# EAGLE design simple-loop-active (EAGLE 6.6.0)

## Sheet 1 of 2
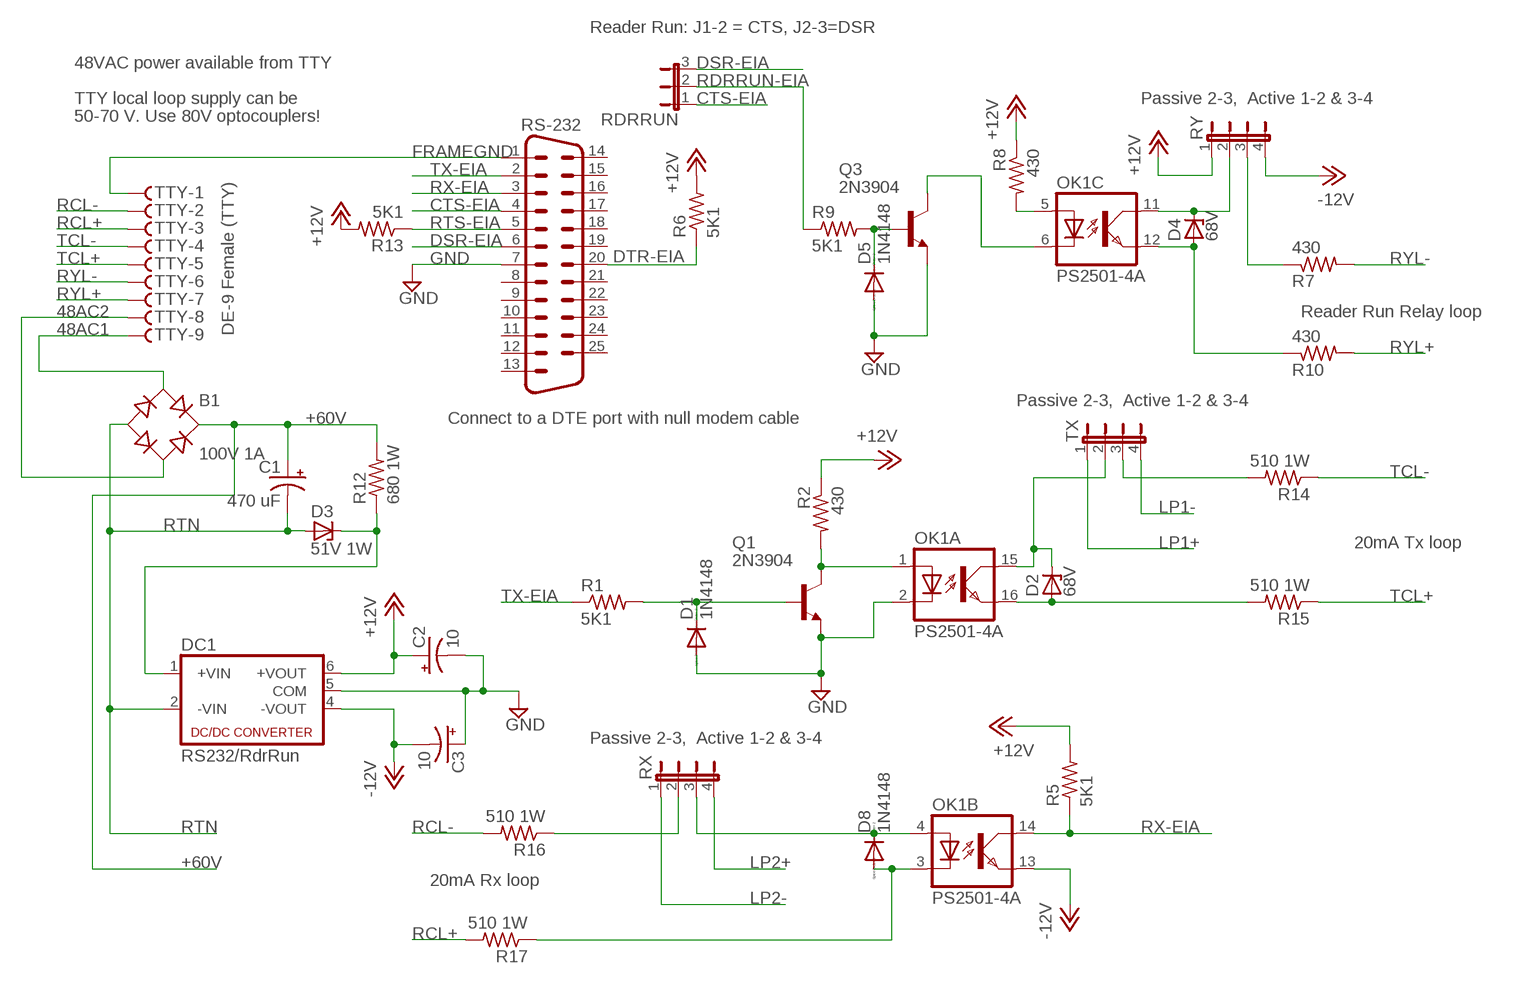
[diagram p0: schematic, sheet 1]

### Parts
B1  100V 1A  RB1A  [RB1A]
C1  470 uF  CPOL-USE7.5-18  [E7,5-18]
C2  10  CPOL-USB45181A  [B45181A]
C3  10  CPOL-USB45181A  [B45181A]
D1  1N4148  1N4148DO35-10  [DO35-10]
D2  68V  ZENER-DIODEDO41Z10  [DO41Z10]
D3  51V 1W  ZENER-DIODEDO41Z10  [DO41Z10]
D4  68V  ZENER-DIODEDO41Z10  [DO41Z10]
D5  1N4148  1N4148DO35-10  [DO35-10]
D8  1N4148  1N4148DO35-10  [DO35-10]
DC1  RS232/RdrRun  NMA  [NMA]
OK1  PS2501-4A  ILQ1  [DIL16]
Q1  2N3904  [TO92]
Q3  2N3904  [TO92]
R1  5K1  R-US_0207/10  [0207/10]
R2  430  R-US_0207/10  [0207/10]
R5  5K1  R-US_0207/10  [0207/10]
R6  5K1  R-US_0207/10  [0207/10]
R7  430  R-US_0207/10  [0207/10]
R8  430  R-US_0207/10  [0207/10]
R9  5K1  R-US_0207/10  [0207/10]
R10  430  R-US_0207/10  [0207/10]
R12  680 1W  R-US_0817/7V  [P0817V]
R13  5K1  R-US_0207/10  [0207/10]
R14  510 1W  R-US_0817/7V  [P0817V]
R15  510 1W  R-US_0817/7V  [P0817V]
R16  510 1W  R-US_0817/7V  [P0817V]
R17  510 1W  R-US_0817/7V  [P0817V]
RDRRUN  JP2E  [JP2]
RS-232  M25H  [M25H]
RX  JP4E  [JP4]
RY  JP4E  [JP4]
TTY  F09HS  [F09H]
TX  JP4E  [JP4]

### Nets
48AC1: B1.AC1 TTY.9
48AC2: B1.AC2 TTY.8
+12V: C2.+ DC1.6(+VOUT) R2.1 R5.2 R6.2 R8.1 R13.2 RY.1
+48VDC: D3.C DC1.1(+VIN) R12.1
+60V: B1.+ C1.+ R12.2 ; also sheet 2
-12V: C3.- DC1.4(-VOUT) OK1.13(B:EMIT) RY.4
CTS-EIA: RDRRUN.1 RS-232.4
DSR-EIA: RDRRUN.3 RS-232.6
DTR-EIA: R6.1 RS-232.20
FRAMEGND: RS-232.1 TTY.1
GND [GND]: C2.- C3.+ D1.A D5.A DC1.5(COM) OK1.2(A:C) Q1.3(E) Q3.3(E) RS-232.7
LP1+: TX.1 ; also sheet 2
LP1-: TX.4 ; also sheet 2
LP2+: RX.4 ; also sheet 2
LP2-: RX.1 ; also sheet 2
N$1: D8.C OK1.4(B:A) RX.3
N$2: R16.1 RX.2
N$3: D8.A OK1.3(B:C) R17.1
N$4: D2.A OK1.16(A:EMIT) R15.2
N$5: OK1.5(C:A) R8.2
N$6: D2.C OK1.15(A:COL) TX.2
N$7: D1.C Q1.2(B) R1.2
N$8: D4.C OK1.11(C:COL) RY.2
N$9: OK1.1(A:A) Q1.1(C) R2.2
N$10: D4.A OK1.12(C:EMIT) R10.1
N$11: R7.1 RY.3
N$15: OK1.6(C:C) Q3.1(C)
N$16: D5.C Q3.2(B) R9.2
N$19: R14.2 TX.3
RCL+: R17.2 TTY.3
RCL-: R16.2 TTY.2
RDRRUN-EIA: R9.1 RDRRUN.2
RTN: B1.- C1.- D3.A DC1.2(-VIN) ; also sheet 2
RTS-EIA: R13.1 RS-232.5
RX-EIA: OK1.14(B:COL) R5.1 RS-232.3
RYL+: R10.2 TTY.7
RYL-: R7.2 TTY.6
TCL+: R15.1 TTY.5
TCL-: R14.1 TTY.4
TX-EIA: R1.1 RS-232.2
Unconnected: RS-232.8 RS-232.9 RS-232.10 RS-232.11 RS-232.12 RS-232.13 RS-232.14 RS-232.15 RS-232.16 RS-232.17 RS-232.18 RS-232.19 RS-232.21 RS-232.22 RS-232.23 RS-232.24 RS-232.25

### Notes on the sheet
- Reader Run: J1-2 = CTS, J2-3=DSR
- 48VAC power available from TTY
- TTY local loop supply can be | Passive 2-3,  Active 1-2 & 3-4
- 50-70 V. Use 80V optocouplers!
- Reader Run Relay loop
- DE-9 Female (TTY)
- Passive 2-3,  Active 1-2 & 3-4
- Connect to a DTE port with null modem cable
- 20mA Tx loop
- Passive 2-3,  Active 1-2 & 3-4
- 20mA Rx loop

## Sheet 2 of 2
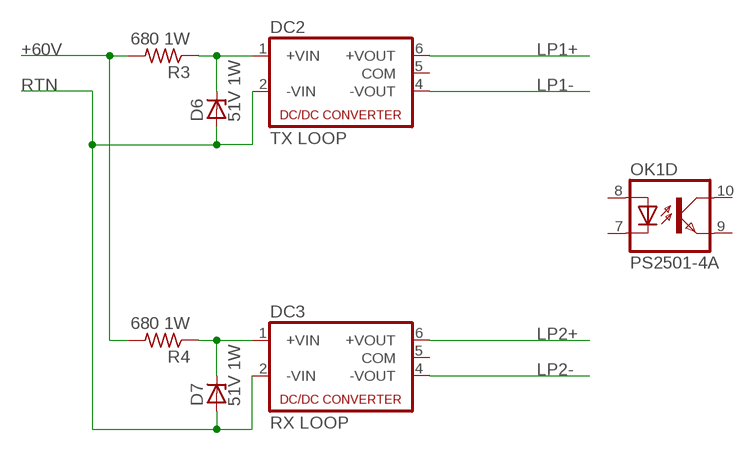
[diagram p1: schematic, sheet 2]

### Parts
D6  51V 1W  ZENER-DIODEDO41Z10  [DO41Z10]
D7  51V 1W  ZENER-DIODEDO41Z10  [DO41Z10]
DC2  TX LOOP  NMA  [NMA]
DC3  RX LOOP  NMA  [NMA]
R3  680 1W  R-US_0817/7V  [P0817V]
R4  680 1W  R-US_0817/7V  [P0817V]

### Nets
+48VDC1: D6.C DC2.1(+VIN) R3.1
+48VDC2: D7.C DC3.1(+VIN) R4.1
+60V: R3.2 R4.2 ; also sheet 1
LP1+: DC2.6(+VOUT) ; also sheet 1
LP1-: DC2.4(-VOUT) ; also sheet 1
LP2+: DC3.6(+VOUT) ; also sheet 1
LP2-: DC3.4(-VOUT) ; also sheet 1
RTN: D6.A D7.A DC2.2(-VIN) DC3.2(-VIN) ; also sheet 1
Unconnected: DC2.5(COM) DC3.5(COM) OK1.7(D:C) OK1.8(D:A) OK1.9(D:EMIT) OK1.10(D:COL)

## Library data of the parts
B1 = rectifier:RB1A: RECTIFIER 1 A
C1-C3 = rcl:CPOL-US: POLARIZED CAPACITOR, American symbol
D1 D5 D8 = diode:1N4148: DIODE high speed (Philips)
D2-D4 D6 D7 = diode:ZENER-DIODE: Z-Diode
DC1-DC3 = dc-dc-converter:NMA: DC-DC CONVERTER; MF: C & D TECHNOLOGIES, INC; MPN: NMA0515SC; OC_FARNELL: 1021434; OC_NEWARK: 61K3064
OK1 = optocoupler:ILQ1: SIEMENS OPTO COUPLER; MF: VISHAY/TELEFUNKEN; MPN: ILQ1; OC_FARNELL: 1469501; OC_NEWARK: 88K1954
Q1 Q3 = transistor-npn:2N3904: NPN Transistor
R1-R10 R12-R17 = rcl:R-US_: RESISTOR, American symbol
RDRRUN = jumper:JP2E: JUMPER
RS-232 = con-subd:M25: SUB-D; OC_FARNELL: unknown; OC_NEWARK: unknown
RX RY TX = jumper:JP4E: JUMPER
TTY = con-subd:F09?S: SUB-D; OC_FARNELL: unknown; OC_NEWARK: unknown

## Net classes
1 GND: width 0.508 mm

## Board
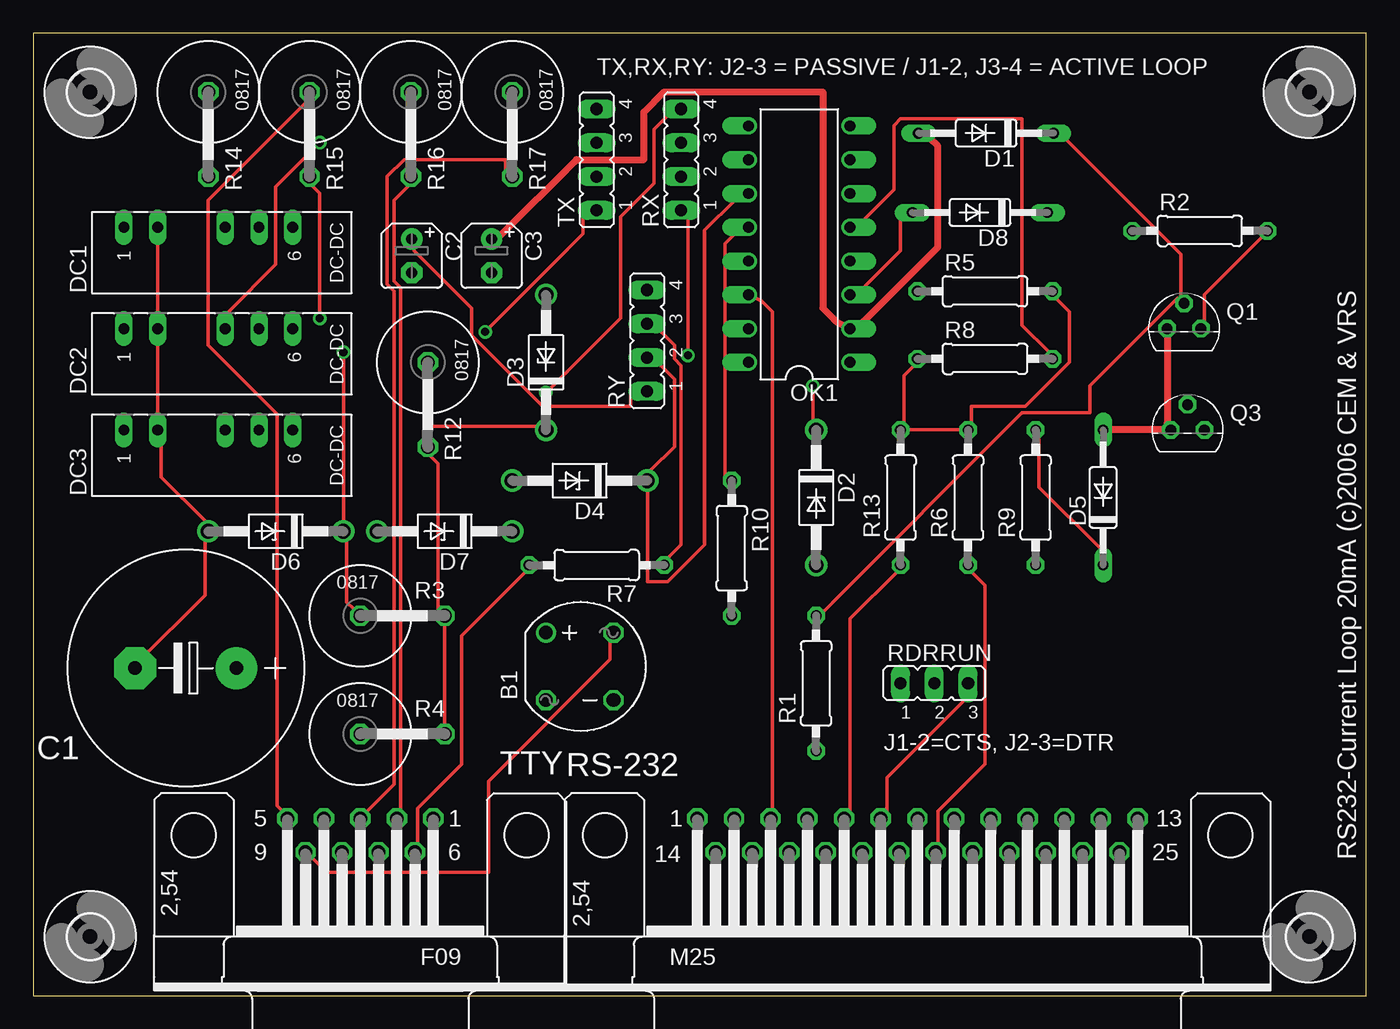
[diagram p2: board, top side]
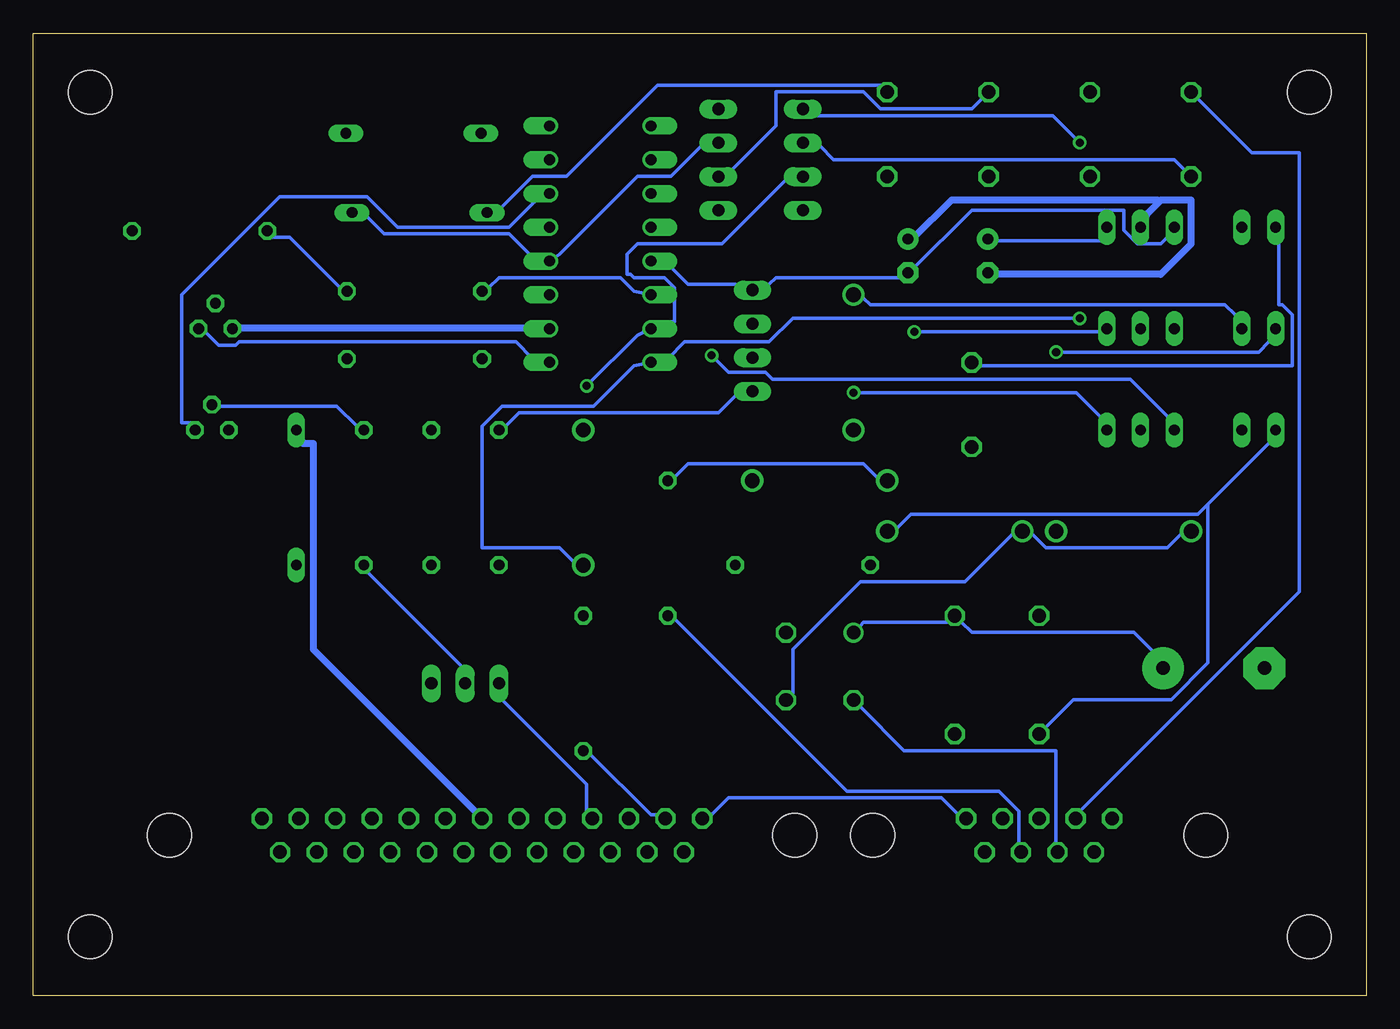
[diagram p3: board, bottom side, seen from below]

Size 100.27 x 72.37 mm. Coordinates in mm from the lower left corner, seen from the top.
Outline: 100.27,0 100.27,72.37 0,72.37 0,0 100.27,0
Copper layers (1*16): Top 0.035mm / dielectric 1.5mm / Bottom 0.035mm
Design rules "10mils *": minimum track width 10mil, minimum drill 24mil, track to track 10mil, track to pad 10mil, pad to pad 10mil, via to via 10mil, smd to smd 10mil, copper to edge 40mil, drill to drill 10mil, minimum pad ring 10mil, minimum via ring 8mil, stop-mask expansion 0mil, vias tented up to drill 0mil, thermal gap 10mil

### Footprints (pad centres in the part's own frame; a part is rotated, then mirrored left to right if it is on the bottom)
RB1A = drill 1.016: + -2.54,2.54 | drill 1.016 octagon: - 2.54,-2.54; AC1 2.54,2.54; AC2 -2.54,-2.54
E7,5-18 = drill 1.016 pad 3.15: + -3.81,0 | drill 1.016 pad 3.15 octagon: - 3.81,0
B45181A = drill 0.813 pad 1.6: + -1.27,0 | drill 0.813 pad 1.6 octagon: - 1.27,0
DO35-10 = drill 0.813 long: A 5.08,0; C -5.08,0
DO41Z10 = drill 1.118: A 5.08,0; C -5.08,0
NMA = drill 0.813 long: 1 0,6.35; 2 0,3.81; 4 0,-1.27; 5 0,-3.81; 6 0,-6.35
DIL16 = drill 0.813 offset: 1 -8.89,-3.81; 2 -6.35,-3.81; 3 -3.81,-3.81; 4 -1.27,-3.81; 5 1.27,-3.81; 6 3.81,-3.81; 7 6.35,-3.81; 8 8.89,-3.81; 9 8.89,3.81; 10 6.35,3.81; 11 3.81,3.81; 12 1.27,3.81; 13 -1.27,3.81; 14 -3.81,3.81; 15 -6.35,3.81; 16 -8.89,3.81
TO92 = drill 0.813 octagon: 1 1.27,0; 2 0,1.905; 3 -1.27,0
0207/10 = drill 0.813 octagon: 1 -5.08,0; 2 5.08,0
P0817V = drill 1.016 octagon: 1 -5.08,0; 2 1.27,0
JP2 = drill 0.914 long: 1 -2.54,0; 2 0,0; 3 2.54,0
M25H = drill 1.016 octagon: 1 -16.561,1.27; 2 -13.792,1.27; 3 -11.049,1.27; 4 -8.28,1.27; 5 -5.512,1.27; 6 -2.769,1.27; 7 0,1.27; 8 2.769,1.27; 9 5.512,1.27; 10 8.28,1.27; 11 11.049,1.27; 12 13.792,1.27; 13 16.561,1.27; 14 -15.189,-1.27; 15 -12.421,-1.27; 16 -9.652,-1.27; 17 -6.909,-1.27; 18 -4.14,-1.27; 19 -1.372,-1.27; 20 1.372,-1.27; 21 4.14,-1.27; 22 6.909,-1.27; 23 9.652,-1.27; 24 12.421,-1.27; 25 15.189,-1.27 | hole 3.302: 23.52,0; -23.52,0
JP4 = drill 0.914 long: 1 -3.81,0; 2 -1.27,0; 3 1.27,0; 4 3.81,0
F09H = drill 1.016 octagon: 1 -5.486,-1.27; 2 -2.743,-1.27; 3 0,-1.27; 4 2.743,-1.27; 5 5.486,-1.27; 6 -4.115,1.27; 7 -1.372,1.27; 8 1.372,1.27; 9 4.115,1.27 | hole 3.302: -12.522,0; 12.522,0
3,3 = hole 3.3: 0,0

### Placement (x,y rotation side)
B1  41.11,24.76 0 top
C1  11.47,24.63 180 top
C2  28.47,55.63 270 top
C3  34.47,55.63 270 top
D1  71.67,64.86 180 top
D2  58.89,37.46 270 top
D3  38.57,47.62 90 top
D4  41.11,38.73 180 top
D5  80.48,37.46 90 top
D6  18.25,34.92 180 top
D7  30.95,34.92 180 top
D8  71.21,58.89 180 top
DC1  13.17,57.78 90 top
DC2  13.17,50.16 90 top
DC3  13.17,42.54 90 top
OK1  57.62,56.51 90 top
Q1  86.56,50.16 0 top
Q3  86.83,42.54 0 top
R1  58.89,23.49 90 top
R2  87.75,57.51 0 top
R3  29.68,28.57 0 top
R4  29.68,19.68 0 top
R5  71.59,52.97 0 top
R6  70.32,37.46 90 top
R7  42.38,32.38 180 top
R8  71.59,47.89 0 top
R9  75.4,37.46 90 top
R10  52.54,33.65 270 top
R12  29.68,42.54 270 top
R13  65.24,37.46 90 top
R14  13.17,62.86 270 top
R15  20.79,62.86 270 top
R16  28.41,62.86 270 top
R17  36.03,62.86 270 top
RDRRUN  67.78,23.49 0 top
RS-232  66.51,12.06 0 top
RX  48.73,62.86 90 top
RY  46.17,49.25 90 top
TTY  24.6,12.06 180 top
TX  42.38,62.86 90 top
U$1  [3,3]  4.28,67.94 0 top
U$2  [3,3]  4.28,4.44 0 top
U$3  [3,3]  95.99,67.94 0 top
U$4  [3,3]  95.99,4.44 0 top

### Tracks (layer width: path | path; a pad name or v marks a point on that pad's centre or on a via)
48AC1
  Top 0.254: TTY.9 21.04,10.3 22.06,9.28 34.25,9.28 34.25,16.14 43.4,25.28 43.4,26.55 B1.AC1
48AC2
  Bottom 0.254: TTY.8 23.33,11.31 23.33,18.43 34.76,18.43 38.06,21.73 B1.AC2
+12V
  Top 0.254: R8.1 66.26,47.38 65.49,46.62 65.49,43.06 R13.2 65.75,42.56 69.81,42.56 R6.2 70.57,43.06 70.57,44.33 74.64,44.33 77.94,47.64 77.94,51.45 76.92,52.46 R5.2 | RY.1 44.92,45.1 44.92,44.33 38.32,44.33 32.98,49.67 32.98,51.7 28.66,56.02 28.66,56.78 C2.+
  Bottom 0.254: R5.2 77.18,53.22 80.99,57.03 82.26,57.03 R2.1 | DC1.6 20.03,56.78 28.41,56.78 C2.+ | RY.1 47.46,45.1 48.73,43.83 63.72,43.83 64.73,42.81 R13.2
+48VDC
  Top 0.254: D3.C 37.81,42.81 29.93,42.81 29.93,46.87 R12.1
  Bottom 0.254: DC1.1 6.57,56.53 6.57,51.95 6.31,51.95 5.55,51.19 5.55,47.38 29.17,47.38 R12.1
+48VDC1  (via drill 0.61)
  Top 0.254: v23.33,48.4 D6.C 23.58,34.17 23.58,29.6 24.09,29.09 R3.1
  Bottom 0.254: v23.33,48.4 8.09,48.4 7.33,49.16 DC2.1
+48VDC2
  Bottom 0.254: 11.9,36.97 12.66,36.21 34.25,36.21 35.27,35.19 D7.C | 11.9,36.97 7.33,41.54 DC3.1 | 11.9,36.97 11.9,25.03 14.68,22.25 22.04,22.25 24.09,20.2 R4.1
+60V
  Top 0.254: R4.2 R3.2 30.44,29.09 30.44,40.02 29.93,40.52 R12.2
  Bottom 0.254: B1.+ 38.06,27.82 37.81,28.08 31.46,28.08 R3.2 30.44,28.08 29.68,27.32 17.49,27.32 15.2,25.03 15.2,24.78 C1.+
-12V
  Bottom 0.254: OK1.13 52.54,55 51.02,53.48 47.46,53.48 RY.4 44.92,53.48 44.41,53.99 34.76,53.99 34.51,54.24 C3.- 34.25,54.49 29.68,59.07 18.25,59.07 18.25,57.54 17.23,56.53 15.46,56.53 14.44,57.54 DC1.4
CTS-EIA
  Bottom 0.254: RDRRUN.1 64.99,22.24 58.64,15.89 58.64,13.85 RS-232.4
DSR-EIA
  Top 0.254: RDRRUN.3 70.07,22.24 64.22,16.39 64.22,13.85 RS-232.6
DTR-EIA
  Top 0.254: R6.1 70.57,31.89 71.59,30.87 71.59,17.41 68.03,13.85 68.03,11.31 RS-232.20
FRAMEGND
  Bottom 0.254: TTY.1 30.7,13.6 31.97,14.87 47.97,14.87 49.24,13.6 RS-232.1
GND
  Top 0.508: D1.A 67.53,64.4 68.03,63.89 68.03,56.27 62.45,50.68 OK1.2 60.41,50.68 59.4,51.7 59.4,67.96 47.46,67.96 45.94,66.43 45.94,62.88 40.86,62.88 35.01,57.03 34.51,57.03 C3.+ | D5.A 80.99,42.56 85.05,42.56 Q3.3 85.31,43.06 85.31,49.67 Q1.3
  Bottom 0.508: 15.58,59.7 16.47,58.81 DC1.5 | 15.58,59.7 15.46,59.83 13.17,59.83 13.17,56.53 15.46,54.24 28.41,54.24 C2.- | 34.12,56.91 31.2,59.83 15.71,59.83 15.58,59.7 | 34.12,56.91 34.25,56.78 | RS-232.7 67.02,13.85 79.21,26.05 79.21,41.54 79.97,41.54 D5.A | OK1.2 62.7,50.18 84.8,50.18 Q1.3 | 34.12,56.91 34.25,57.03 C3.+
LP1+  (via drill 0.61)
  Top 0.254: v34,49.92 41.36,57.29 41.36,58.56 TX.1
  Bottom 0.254: v34,49.92 20.03,49.92 DC2.6
LP1-  (via drill 0.61)
  Top 0.254: v21.55,64.15 18.25,60.84 18.25,55 14.69,51.45 DC2.4
  Bottom 0.254: v21.55,64.15 23.58,66.18 41.36,66.18 TX.4
LP2+  (via drill 0.61)
  Top 0.254: v38.57,45.35 44.16,50.94 44.16,58.56 46.7,61.1 46.7,65.16 47.71,66.18 RX.4
  Bottom 0.254: v38.57,45.35 21.81,45.35 20.03,43.57 DC3.6
LP2-  (via drill 0.61)
  Top 0.254: v49.24,48.14 49.24,58.56 RX.1
  Bottom 0.254: v49.24,48.14 47.97,46.87 45.17,46.87 44.67,46.37 17.74,46.37 14.95,43.57 DC3.4
N$1
  Bottom 0.254: D8.C 75.15,58.56 73.88,57.29 64.48,57.29 62.7,55.51 OK1.4 60.67,55.76 54.83,61.61 52.29,61.61 50,63.89 RX.3
N$2
  Bottom 0.254: RX.2 47.71,62.11 44.41,65.42 44.41,67.96 37.81,67.96 36.54,66.69 29.68,66.69 28.92,67.45 R16.1
N$3
  Top 0.254: OK1.3 62.45,53.22 65.24,56.02 65.24,58.3 D8.A
  Bottom 0.254: R17.1 36.54,68.46 53.3,68.46 60.16,61.61 62.7,61.61 64.99,59.32 D8.A
N$4  (via drill 0.61)
  Top 0.254: v21.55,50.94 21.55,60.34 21.04,60.84 R15.2
  Bottom 0.254: D2.A 59.65,32.65 60.67,33.67 66.51,33.67 66.51,42.81 64.99,44.33 58.13,44.33 55.08,47.38 OK1.16 52.54,47.89 51.27,49.16 44.92,49.16 43.14,50.94 v21.55,50.94
N$5
  Top 0.254: OK1.5 62.45,58.3 64.73,60.59 64.73,65.42 65.24,65.92 74.38,65.92 74.38,50.43 76.42,48.4 R8.2
N$6  (via drill 0.61)
  Top 0.254: v58.64,45.86 58.64,43.32 D2.C
  Bottom 0.254: v58.64,45.86 54.83,49.67 OK1.15 52.79,50.68 52.03,50.68 52.03,53.22 52.79,53.99 55.08,53.99 55.33,54.24 55.59,54.24 55.59,55.76 54.83,56.53 48.48,56.53 43.65,61.35 TX.2
N$7
  Top 0.254: R1.2 59.4,28.84 74.38,43.83 79.46,43.83 79.46,45.86 86.07,52.46 Q1.2 86.32,52.72 86.32,55.76 77.69,64.4 D1.C
N$8
  Top 0.254: OK1.11 52.79,59.83 50.51,57.54 50.51,33.92 47.71,31.13 46.19,31.13 D4.C 46.44,39.51 48.22,41.29 48.22,46.37 47.21,47.38 RY.2
N$9
  Top 0.254: R2.2 92.42,57.03 88.1,52.72 88.1,50.68 Q1.1
  Bottom 0.254: OK1.1 62.7,47.89 63.97,49.16 84.8,49.16 85.05,48.91 86.32,48.91 87.34,49.92 Q1.1
N$10
  Top 0.254: OK1.12 52.79,57.29 52.03,56.53 52.03,39 R10.1
  Bottom 0.254: R10.1 52.03,39 51.02,40.02 37.81,40.02 36.79,39 D4.A
N$11
  Top 0.254: R7.1 47.71,32.9 48.73,33.92 48.73,47.38 48.22,47.89 48.22,48.91 47.21,49.92 RY.3
N$15
  Bottom 0.254: OK1.6 62.45,59.83 64.48,57.8 72.86,57.8 75.15,60.08 81.75,60.08 89.12,52.72 89.12,43.06 88.35,43.06 Q3.1
N$16
  Top 0.254: D5.C 80.23,33.67 75.65,38.24 75.65,42.05 R9.2
  Bottom 0.254: Q3.2 86.32,44.33 77.43,44.33 75.91,42.81 R9.2
N$19
  Bottom 0.254: TX.3 41.11,63.89 40.09,62.88 14.44,62.88 13.68,62.11 R14.2
RCL+
  Top 0.254: TTY.3 25.11,13.85 27.14,15.89 27.14,52.97 26.63,53.48 26.63,61.61 27.9,62.88 35.52,62.88 35.52,62.11 R17.2
RCL-
  Top 0.254: TTY.2 27.65,13.85 27.65,53.22 27.14,53.73 27.14,59.83 28.16,60.84 R16.2
RDRRUN-EIA
  Bottom 0.254: R9.1 75.15,31.89 68.03,24.78 RDRRUN.2
RTN
  Top 0.254: DC1.2 DC2.2 DC3.2 9.61,41.29 9.61,39 12.92,35.7 D6.A 12.92,34.17 12.92,30.11 7.84,25.03 7.84,24.78 C1.-
  Bottom 0.254: B1.- 43.14,22.74 43.14,26.05 38.06,31.13 30.19,31.13 26.63,34.68 D7.A 25.11,34.68 24.09,33.67 14.95,33.67 13.93,34.68 D6.A | D3.A 37.81,52.46 37.3,51.95 10.63,51.95 9.87,51.19 DC2.2
RTS-EIA
  Top 0.254: R13.1 64.99,31.89 61.43,28.33 61.43,13.85 RS-232.5
RX-EIA
  Top 0.254: RS-232.3 55.59,13.85 55.59,51.45 54.83,52.21 OK1.14
  Bottom 0.254: OK1.14 55.08,52.97 56.1,53.99 65.24,53.99 66,53.22 R5.1
RYL+
  Bottom 0.254: R10.2 52.03,28.33 39.08,15.38 27.65,15.38 26.12,13.85 26.12,11.31 TTY.7
RYL-
  Top 0.254: R7.2 37.05,31.89 32.22,27.06 32.22,17.41 28.92,14.11 28.92,11.31 TTY.6
TCL+
  Top 0.254: TTY.5 18.76,13.85 18.34,14.27 18.34,43.73 13.17,48.91 13.17,59.83 20.54,67.19 R15.1
TCL-
  Bottom 0.254: TTY.4 21.55,13.85 5.04,30.36 5.04,63.38 8.6,63.38 12.66,67.45 R14.1
TX-EIA
  Bottom 0.254: R1.1 58.38,18.17 53.81,13.6 53.3,13.6 RS-232.2

### Text on the board
tNames: TX,RX,RY: J2-3 = PASSIVE / J1-2, J3-4 = ACTIVE LOOP | J1-2=CTS, J2-3=DTR | RS232-Current Loop 20mA (c)2006 CEM & VRS